# EAGLE design motorcontroller (EAGLE 5.10)
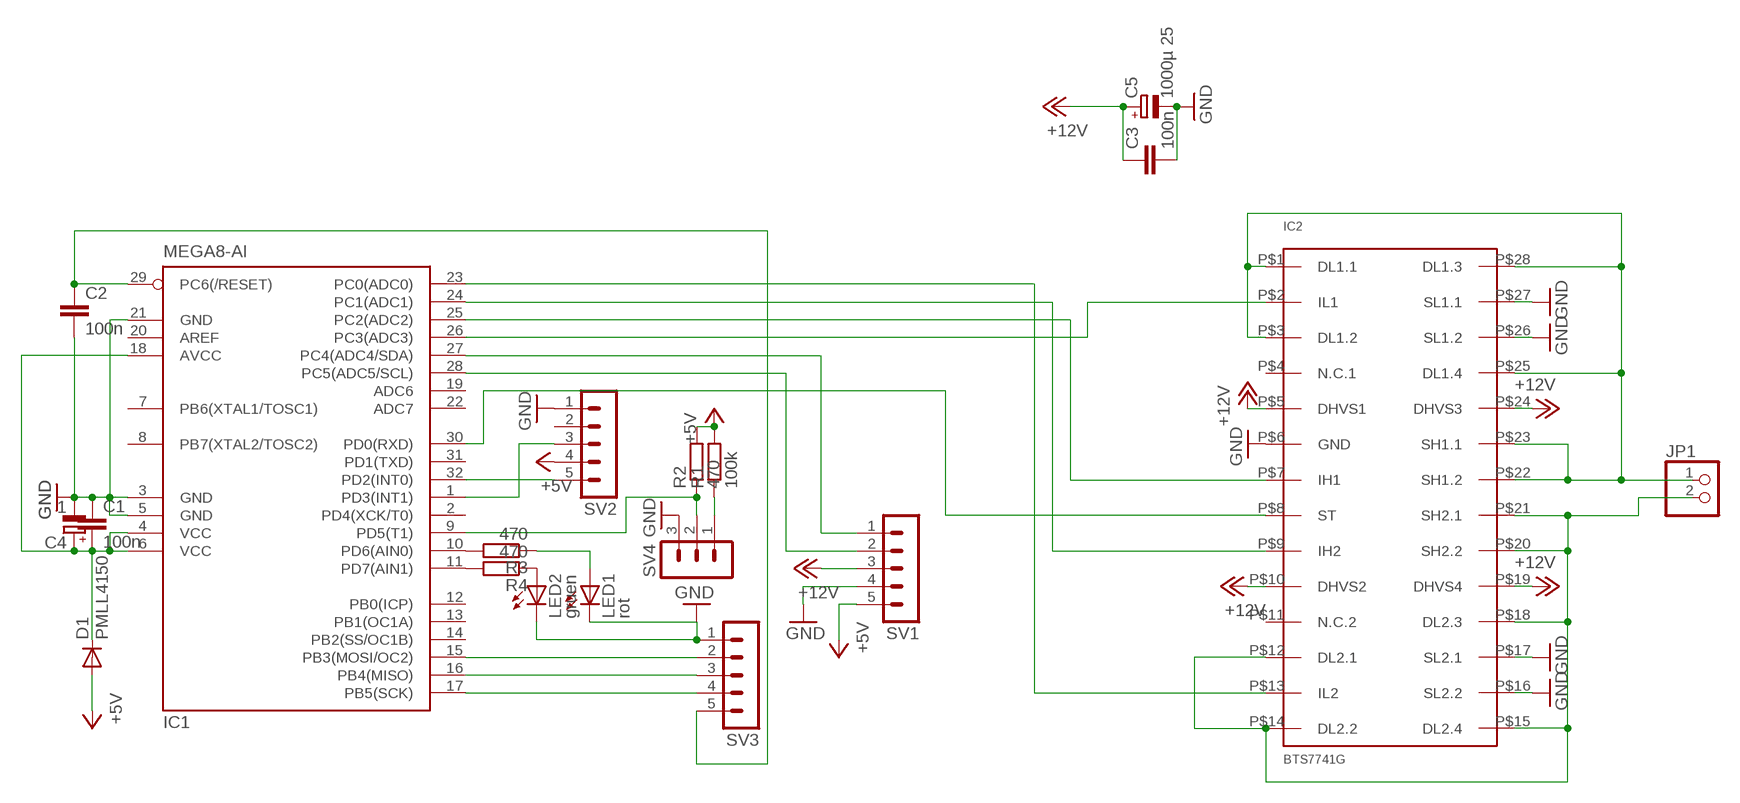
[diagram p0: schematic, sheet 1]

## Parts
C1  100n  C-EUC0805  [C0805]
C2  100n  C-EUC0805  [C0805]
C3  100n  C-EUC0805  [C0805]
C4  1  CPOL-EUE7.5-18  [E7,5-18]
C5  1000µ 25  CPOL-EUE5-10.5  [E5-10,5]
D1  PMLL4150  [SOD80C]
IC1  MEGA8-AI  [TQFP32-08]
IC2  BTS7741G  [P-DSO-28-14]
JP1  PINHD-1X2  [1X02]
LED1  rot  LEDCHIPLED_0805  [CHIPLED_0805]
LED2  gruen  LEDCHIPLED_0805  [CHIPLED_0805]
R1  100k  R-EU_R0805  [R0805]
R2  470  R-EU_R0805  [R0805]
R3  470  R-EU_R0805  [R0805]
R4  470  R-EU_R0805  [R0805]
SV1  MA05-1  [MA05-1]
SV2  MA05-1  [MA05-1]
SV3  MA05-1  [MA05-1]
SV4  MA03-1  [MA03-1]

## Nets
+5V: D1.A R1.2 R2.2 SV1.5 SV2.4
+12V: C3.1 C5.+ IC2.P$5(DHVS1) IC2.P$10(DHVS2) IC2.P$19(DHVS4) IC2.P$24(DHVS3) SV1.3
GND: C1.1 C2.2 C3.2 C4.- C5.- IC1.3(GND) IC1.5(GND) IC1.21(GND) IC2.P$6(GND) IC2.P$16(SL2.2) IC2.P$17(SL2.1) IC2.P$26(SL1.2) IC2.P$27(SL1.1) LED1.C LED2.C SV1.4 SV2.1 SV3.1 SV4.3
N$1: IC2.P$1(DL1.1) IC2.P$3(DL1.2) IC2.P$22(SH1.2) IC2.P$23(SH1.1) IC2.P$25(DL1.4) IC2.P$28(DL1.3) JP1.1
N$2: IC2.P$12(DL2.1) IC2.P$14(DL2.2) IC2.P$15(DL2.4) IC2.P$18(DL2.3) IC2.P$20(SH2.2) IC2.P$21(SH2.1) JP1.2
N$3: IC1.23(PC0(ADC0)) IC2.P$13(IL2)
N$6: IC1.25(PC2(ADC2)) IC2.P$7(IH1)
N$7: IC1.30(PD0(RXD)) IC2.P$8(ST)
N$8: IC1.26(PC3(ADC3)) IC2.P$2(IL1)
N$9: IC1.17(PB5(SCK)) SV3.4
N$10: C2.1 IC1.29(PC6(/RESET)) SV3.5
N$11: IC1.16(PB4(MISO)) SV3.3
N$12: IC1.15(PB3(MOSI/OC2)) SV3.2
N$13: R1.1 SV4.1
N$14: IC1.32(PD2(INT0)) SV2.5
N$15: IC1.1(PD3(INT1)) SV2.3
N$16: IC1.11(PD7(AIN1)) R4.2
N$17: LED2.A R4.1
N$18: C1.2 C4.+ D1.C IC1.4(VCC) IC1.6(VCC) IC1.18(AVCC)
N$20: IC1.24(PC1(ADC1)) IC2.P$9(IH2)
N$21: IC1.10(PD6(AIN0)) R3.2
N$23: LED1.A R3.1
N$24: IC1.9(PD5(T1)) R2.1 SV4.2
SCL: IC1.28(PC5(ADC5/SCL)) SV1.2
SDA: IC1.27(PC4(ADC4/SDA)) SV1.1
Unconnected: IC1.2(PD4(XCK/T0)) IC1.7(PB6(XTAL1/TOSC1)) IC1.8(PB7(XTAL2/TOSC2)) IC1.12(PB0(ICP)) IC1.13(PB1(OC1A)) IC1.14(PB2(SS/OC1B)) IC1.19(ADC6) IC1.20(AREF) IC1.22(ADC7) IC1.31(PD1(TXD)) IC2.P$4(N.C.1) IC2.P$11(N.C.2) SV2.2

## Library data of the parts
C1-C3 = rcl:C-EU: CAPACITOR, European symbol
C4 C5 = rcl:CPOL-EU: POLARIZED CAPACITOR, European symbol
D1 = diode:PMLL4150: DIODE high speed
IC1 = atmel:MEGA8: MICROCONTROLLER 8 Kbytes FLASH, 1 kbytes SRAM, 512 bytes EEPROM, USART, 6-channel 10 bit ADC, 2-channel 8 bit ADC Pin compatible with Atmega48, ATMega88, ATMega168 Source: avr.lbr
IC2 = Labor:BTS7741G: H-Bridge DC Motor driver Quad D-MOS switch driver Free configurable as bridge or quad-switch Optimized for DC motor management applications Low RDS ON: 110 m? high-side switch, 100 m? low-side switch (typical values @ 25 °C) Maximum peak current: typ. 10 A @ 25 °C Very low quiescent current: typ. 5 ?A @ 25 °C Small outline, enhanced power P-DSO-package Full short-circuit-protection Operates up to 40 V Status flag diagnosis Overtemperature shut down with hysteresis Internal clamp diodes Open load detection in Off-mode Under-voltage detection with hysteresis PWM frequencies up to 1 kHz
JP1 = pinhead:PINHD-1X2: PIN HEADER
LED1 LED2 = led:LED: LED OSRAM: - CHIPLED LG R971, LG N971, LY N971, LG Q971, LY Q971, LO R971, LY R971 LH N974, LH R974 LS Q976, LO Q976, LY Q976 LO Q996 - Hyper CHIPLED LW Q18S LB Q993, LB Q99A, LB R99A - SideLED LS A670, LO A670, LY A670, LG A670, LP A670 LB A673, LV A673, LT A673, LW A673 LH A674 LY A675 LS A676, LA A676, LO A676, LY A676, LW A676 LS A679, LY A679, LG A679 - Hyper Micro SIDELED® LS Y876, LA Y876, LO Y876, LY Y876 LT Y87S - SmartLED LW L88C, LW L88S LB L89C, LB L89S, LG L890 LS L89K, LO L89K, LY L89K LS L896, LA L896, LO L896, LY L896 - TOPLED LS T670, LO T670, LY T670, LG T670, LP T670 LSG T670, LSP T670, LSY T670, LOP T670, LYG T670 LG T671, LOG T671, LSG T671 LB T673, LV T673, LT T673, LW T673 LH T674 LS T676, LA T676, LO T676, LY T676, LB T676, LH T676, LSB T676, LW T676 LB T67C, LV T67C, LT T67C, LS T67K, LO T67K, LY T67K, LW E67C LS E67B, LA E67B, LO E67B, LY E67B, LB E67C, LV E67C, LT E67C LW T67C LS T679, LY T679, LG T679 LS T770, LO T770, LY T770, LG T770, LP T770 LB T773, LV T773, LT T773, LW T773 LH T774 LS E675, LA E675, LY E675, LS T675 LS T776, LA T776, LO T776, LY T776, LB T776 LHGB T686 LT T68C, LB T68C - Hyper Mini TOPLED® LB M676 - Mini TOPLED Santana® LG M470 LS M47K, LO M47K, LY M47K Source: http://www.osram.convergy.de LUXEON: - LUMILED® LXK2-PW12-R00, LXK2-PW12-S00, LXK2-PW14-U00, LXK2-PW14-V00 LXK2-PM12-R00, LXK2-PM12-S00, LXK2-PM14-U00 LXK2-PE12-Q00, LXK2-PE12-R00, LXK2-PE12-S00, LXK2-PE14-T00, LXK2-PE14-U00 LXK2-PB12-K00, LXK2-PB12-L00, LXK2-PB12-M00, LXK2-PB14-N00, LXK2-PB14-P00, LXK2-PB14-Q00 LXK2-PR12-L00, LXK2-PR12-M00, LXK2-PR14-Q00, LXK2-PR14-R00 LXK2-PD12-Q00, LXK2-PD12-R00, LXK2-PD12-S00 LXK2-PH12-R00, LXK2-PH12-S00 LXK2-PL12-P00, LXK2-PL12-Q00, LXK2-PL12-R00 Source: www.luxeon.com KINGBRIGHT: KA-3528ASYC Source: www.kingbright.com
R1-R4 = rcl:R-EU_: RESISTOR, European symbol
SV1-SV3 = con-lstb:MA05-1: PIN HEADER
SV4 = con-lstb:MA03-1: PIN HEADER

## Net classes
0 default: clearance 0.15 mm

## Board
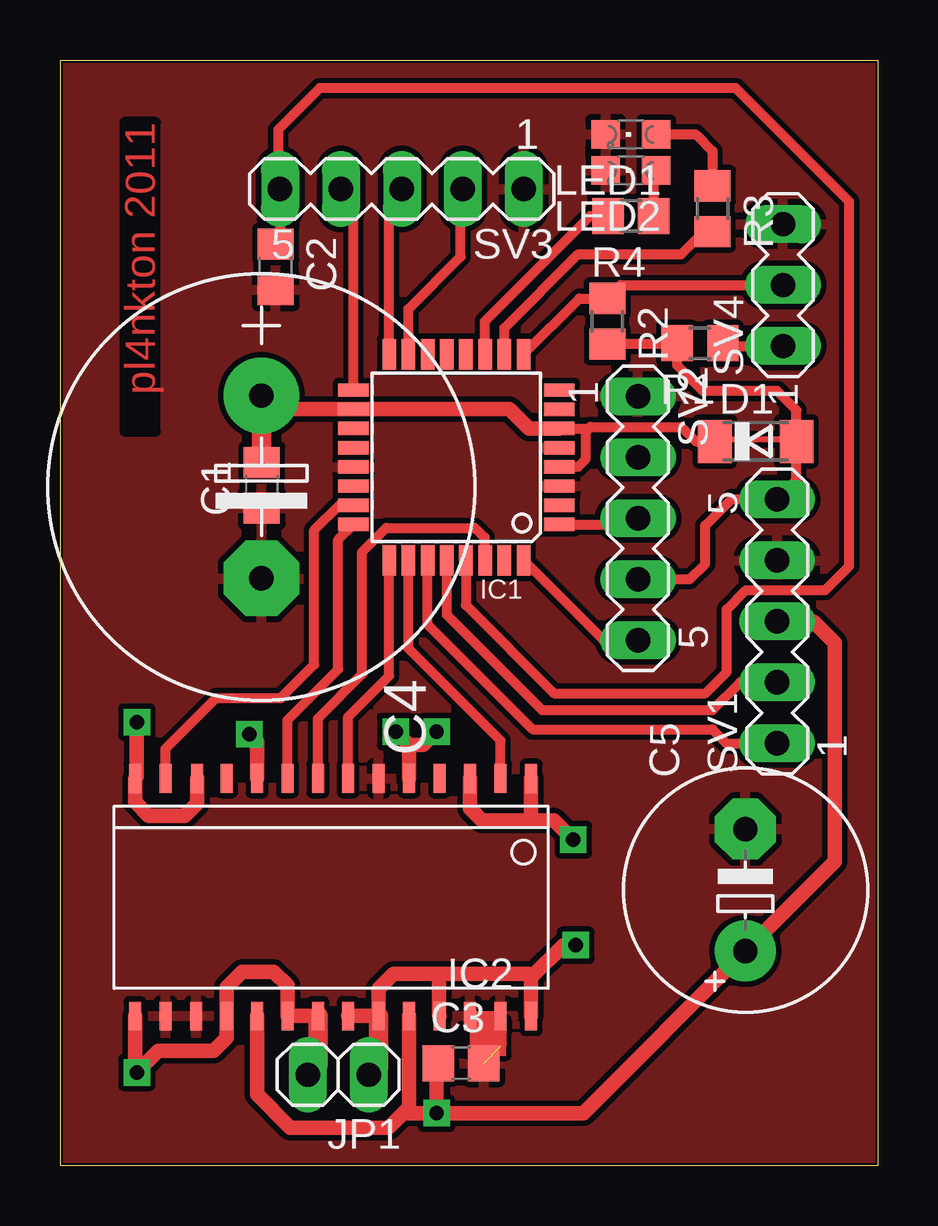
[diagram p1: board, top side]
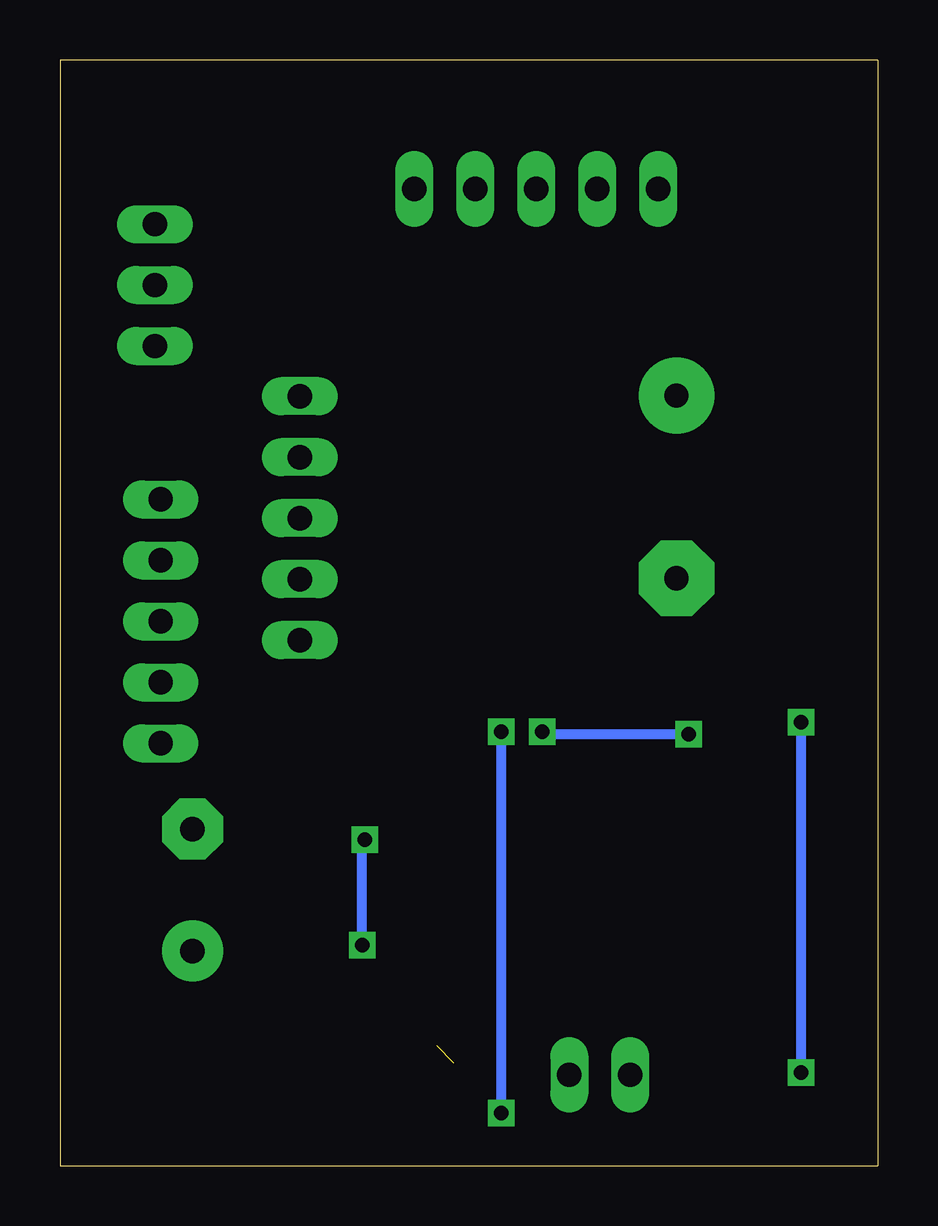
[diagram p2: board, bottom side, seen from below]

Size 34.1 x 46.1 mm. Coordinates in mm from the lower left corner, seen from the top.
Outline: 0,46.1 34.1,46.1 34.1,0 0,0 0,46.1
Copper layers (1*16): Top 0.035mm / dielectric 1.5mm / Bottom 0.035mm
Design rules "default *": minimum track width 10mil, minimum drill 24mil, track to track 9mil, track to pad 8mil, pad to pad 8mil, via to via 8mil, smd to smd 8mil, copper to edge 0.1mm, drill to drill 8mil, minimum pad ring 11mil, minimum via ring 10mil, stop-mask expansion 4mil, vias tented up to drill 0mil, thermal gap 10mil

### Footprints (pad centres in the part's own frame; a part is rotated, then mirrored left to right if it is on the bottom)
C0805 = smd 1.3 x 1.5: 1 -0.95,0; 2 0.95,0
E7,5-18 = drill 1.016 pad 3.15 round: + -3.81,0 | drill 1.016 pad 3.15 octagon: - 3.81,0
E5-10,5 = drill 1.016 pad 2.54 round: + -2.54,0 | drill 1.016 pad 2.54 octagon: - 2.54,0
SOD80C = smd 1.4 x 1.8: A 1.7,0; C -1.7,0
TQFP32-08 = smd 1.27 x 0.559: 1 -4.293,2.8; 2 -4.293,2; 3 -4.293,1.2; 4 -4.293,0.4; 5 -4.293,-0.4; 6 -4.293,-1.2; 7 -4.293,-2; 8 -4.293,-2.8; 17 4.293,-2.8; 18 4.293,-2; 19 4.293,-1.2; 20 4.293,-0.4; 21 4.293,0.4; 22 4.293,1.2; 23 4.293,2; 24 4.293,2.8 | smd 0.559 x 1.27: 9 -2.8,-4.293; 10 -2,-4.293; 11 -1.2,-4.293; 12 -0.4,-4.293; 13 0.4,-4.293; 14 1.2,-4.293; 15 2,-4.293; 16 2.8,-4.293; 25 2.8,4.293; 26 2,4.293; 27 1.2,4.293; 28 0.4,4.293; 29 -0.4,4.293; 30 -1.2,4.293; 31 -2,4.293; 32 -2.8,4.293
P-DSO-28-14 = smd 0.5 x 1.2: P$1 -8.34,-4.95; P$2 -7.07,-4.95; P$3 -5.8,-4.95; P$4 -4.53,-4.95; P$5 -3.26,-4.95; P$6 -1.99,-4.95; P$7 -0.72,-4.95; P$8 0.55,-4.95; P$9 1.82,-4.95; P$10 3.09,-4.95; P$11 4.36,-4.95; P$12 5.59,-4.95; P$13 6.9,-4.95; P$14 8.17,-4.95; P$15 8.17,4.95; P$16 6.9,4.95; P$17 5.63,4.95; P$18 4.36,4.95; P$19 3.09,4.95; P$20 1.82,4.95; P$21 0.55,4.95; P$22 -0.72,4.95; P$23 -1.99,4.95; P$24 -3.26,4.95; P$25 -4.53,4.95; P$26 -5.8,4.95; P$27 -7.07,4.95; P$28 -8.34,4.95
1X02 = drill 1.016 long: 1 -1.27,0; 2 1.27,0
CHIPLED_0805 = smd 1.2 x 1.2: A 0,-1.05; C 0,1.05
R0805 = smd 1.3 x 1.5: 1 -0.95,0; 2 0.95,0
MA05-1 = drill 1.016 long: 1 -5.08,0; 2 -2.54,0; 3 0,0; 4 2.54,0; 5 5.08,0
MA03-1 = drill 1.016 long: 1 -2.54,0; 2 0,0; 3 2.54,0

### Placement (x,y rotation side)
C1  8.41,28.37 90 top
C2  8.99,37.48 270 top
C3  16.72,4.29 0 top
C4  8.4,28.3 270 top
C5  28.57,11.5 90 top
D1  29,30.2 0 top
IC1  16.52,29.54 180 top
IC2  11.3,11.2 180 top
JP1  11.6,3.8 180 top
LED1  23.8,43 90 top
LED2  23.8,41.5 90 top
R1  26.68,34.29 180 top
R2  22.82,35.21 270 top
R3  27.2,39.9 270 top
R4  23.8,39.6 180 top
SV1  29.9,22.7 90 top
SV2  24.1,27 270 top
SV3  14.25,40.73 180 top
SV4  30.14,36.72 90 top

### Tracks (layer width: path | path; a pad name or v marks a point on that pad's centre or on a via)
+5V
  Top 0.406: 22.4,33.84 R2.2 25.16,34.26 R1.2 25.73,33.37 26.8,32.3 29.9,32.3 30.7,31.5 D1.A 30.7,28.58 SV1.5 29.88,27.8 28,27.8 26.9,26.7 26.9,25.1 26.26,24.46 SV2.4
+12V  (via drill 0.6)
  Top 0.406: IC2.P$10 | IC2.P$19 | IC2.P$5 14.5,16.09 | C3.1 15.59,4.29
  Top 0.61: SV1.3 31.4,22.7 32.3,21.8 32.3,12.69 C5.+ 21.82,2.2 v15.7,2.2 | IC2.P$19 8.21,2.99 9.6,1.6 13.7,1.6 14.5,2.4 14.5,2.2 v15.7,2.2 | v15.7,2.2 14.56,2.2 IC2.P$24 | C3.1 15.7,4.29 v15.7,2.2 | IC2.P$10 8.21,17.69 v7.9,18 | 14.56,17.54 IC2.P$5 | 14.56,17.54 v14,18.1 | 14.56,17.54 15.14,17.54 v15.7,18.1
  Bottom 0.406: v7.9,18 13.9,18 v14,18.1 | v15.7,2.2 v15.7,18.1
GND  (1 unrouted)
  Top 0.406: IC2.P$26 IC2.P$27 18.4,6.22 18.4,5.01 18.39,5 18.4,5
  pour Top: -1.2,47.9 -1.2,-0.7 36.7,-0.7 36.7,47.9
N$1  (via drill 0.6)
  Top 0.406: IC2.P$1 19.6,16.11
  Top 0.61: IC2.P$22 IC2.P$23 13.29,7.39 13.9,8 15.9,8 | IC2.P$25 15.8,6.28 15.8,7.9 15.9,8 | 15.9,8 19.5,8 19.64,7.86 | 19.64,7.86 IC2.P$28 | v21.5,9.2 20.98,9.2 19.64,7.86 | IC2.P$3 17.1,14.9 17.6,14.4 19.8,14.4 | 19.8,14.4 20.6,14.4 v21.4,13.6 | IC2.P$1 19.64,14.56 19.8,14.4
  Top 0.813: IC2.P$23 13.29,4.22 arc-90 JP1.1
  Bottom 0.406: v21.5,9.2 21.5,13.5 v21.4,13.6
N$2  (via drill 0.6)
  Top 0.406: IC2.P$12 | IC2.P$15 3.1,6.22 | v3.2,3.9 3.13,3.9
  Top 0.61: IC2.P$21 IC2.P$20 9.48,7.52 8.9,8.1 7.6,8.1 6.94,7.44 IC2.P$18 6.94,5.34 6.4,4.8 4.1,4.8 v3.2,3.9 | 3.13,3.9 IC2.P$15 | IC2.P$12 5.71,15.11 5.2,14.6 3.7,14.6 3.13,15.17 IC2.P$14 3.2,16.22 v3.2,18.5
  Top 0.813: JP1.2 10.75,4.22 IC2.P$21
  Bottom 0.406: v3.2,3.9 v3.2,18.5
N$3
  Top 0.406: IC1.23 12.17,27.6 11.7,27.6 10.6,26.5 10.6,20.9 9.2,19.5 6.5,19.5 4.4,17.4 IC2.P$13
N$6
  Top 0.406: IC1.25 13.72,20.43 12.02,18.72 IC2.P$7
N$7
  Top 0.406: IC2.P$8 10.75,18.65 12.6,20.5 12.6,25.6 13.6,26.6 17.3,26.6 17.7,26.2 17.7,25.27 IC1.30
N$8
  Top 0.406: IC2.P$2 18.37,17.73 14.95,21.15 14.6,21.5 14.53,21.57 IC1.26
N$9
  Top 0.406: SV3.4 12.23,40.2 IC1.17
N$10
  Top 0.406: IC1.29 16.93,23.38 20.6,19.7 26.9,19.7 27.8,20.6 27.8,23.2 28.6,24 31.9,24 32.9,25 32.9,40.2 28.18,44.92 10.82,44.92 9.1,43.2 9.1,40.8 SV3.5 9.17,38.6 C2.1
N$11
  Top 0.406: SV3.3 13.72,40.2 IC1.16
N$12
  Top 0.406: IC1.15 14.53,35.73 16.7,37.9 16.7,40.63 SV3.2
N$13
  Top 0.406: R1.1 27.75,34.17 SV4.1
N$14
  Top 0.406: IC1.32 22.65,21.92 SV2.5
N$15
  Top 0.406: SV2.3 23.84,26.74 IC1.1
N$16
  Top 0.406: IC1.11 17.73,35.23 22.1,39.6 R4.2
N$17
  Top 0.406: R4.1 24.75,41.6 LED2.A
N$18
  Top 0.406: IC1.4 21.6,29.14 21.9,29.44 21.9,30.6 22.04,30.74 | 27.1,29.6 27,29.7 27.3,30 D1.C 26.5,30.2 25.9,30.8 22.1,30.8 22.04,30.74 | IC1.6 22.04,30.74
  Top 0.61: C4.+ 8.4,31.54 IC1.18 18.75,31.54 19.55,30.74 IC1.6
  Top 0.813: C1.2 C4.+
N$19
  Top 0.254: 30.5,30.3 27.6,30.3 27.6,30.2
N$20
  Top 0.406: IC2.P$9 9.48,18.58 11.6,20.7 11.6,26.11 IC1.24
N$21
  Top 0.406: R3.2 26.85,38.95 25.9,38 21.6,38 18.52,34.92 IC1.10
N$23
  Top 0.406: R3.1 27.2,42.3 26.5,43 LED1.A
N$24
  Top 0.406: IC1.9 21.65,36.16 R2.1 23.37,36.72 SV4.2
SCL
  Top 0.406: IC1.28 16.12,22.98 20.1,19 27.2,19 28.36,20.16 SV1.2
SDA
  Top 0.406: 15.3,25.22 IC1.27 15.32,22.57 19.7,18.2 27.2,18.2 27.78,17.62 SV1.1
(copper drawn outside any net)
  shapes: Top area x1

### Text on the board
Top: pl4nkton 2011